# EAGLE design ArduinoShieldMotor5A (EAGLE 9.6.2)
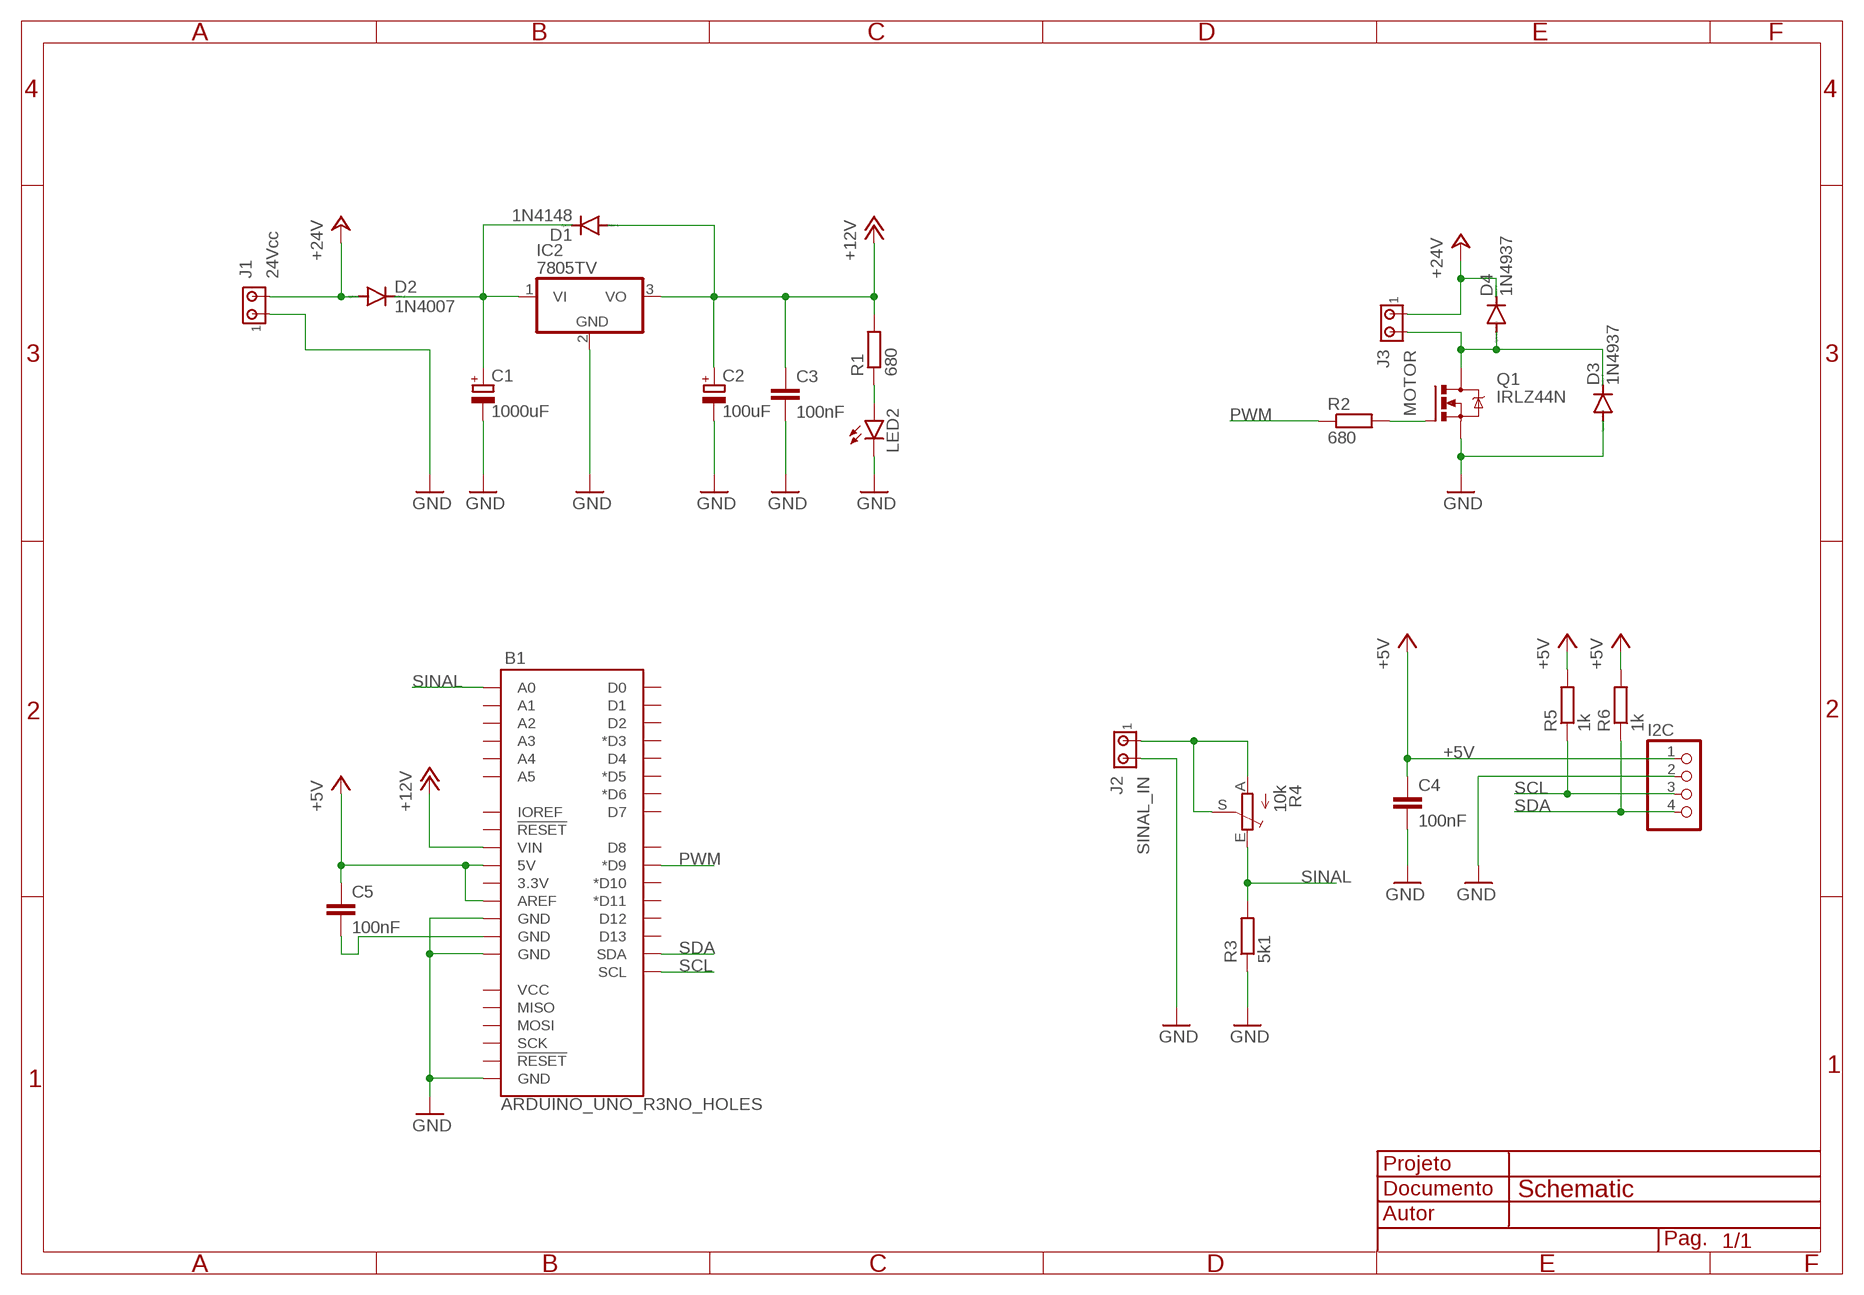
[diagram p0: schematic, sheet 1]

## Parts
B1  ARDUINO_UNO_R3NO_HOLES  [ARDUINO_R3_NO_HOLES]
C1  1000uF  CPOL-EUE5-13  [E5-13]
C2  100uF  CPOL-EUE2.5-5  [E2,5-5]
C3  100nF  C-EU025-025X050  [C025-025X050]
C4  100nF  C-EU025-025X050  [C025-025X050]
C5  100nF  C-EU025-025X050  [C025-025X050]
D1  1N4148  1N4148DO35-10  [DO35-10]
D2  1N4007  1N4004  [DO41-10]
D3  1N4937  1N4004  [DO41-10]
D4  1N4937  1N4004  [DO41-10]
I2C  PINHD-1X4  [1X04]
IC2  7805TV  [TO220V]
J1  24Vcc  MTA02-156  [1X2MTA]
J2  SINAL_IN  MTA02-156  [1X2MTA]
J3  MOTOR  MTA02-156  [1X2MTA]
LED2  LED3MM  [LED3MM]
Q1  IRLZ44N  IRF540  [TO220BV]
R1  680  R-EU_0207/10  [0207/10]
R2  680  R-EU_0207/10  [0207/10]
R3  5k1  R-EU_0207/10  [0207/10]
R4  10k  TRIM_EU-B64Y  [B64Y]
R5  1k  R-EU_0207/10  [0207/10]
R6  1k  R-EU_0207/10  [0207/10]

## Nets
+5V [power]: B1.5V B1.AREF C4.1 C5.1 I2C.1 R5.2 R6.2
+12V: B1.VIN C2.+ C3.1 D1.A IC2.3(VO) R1.2
+24V [power]: D2.A D4.C J1.2 J3.1
GND: B1.GND@1(GND) B1.GND@2(GND) B1.GND@4(GND) C1.- C2.- C3.2 C4.2 D3.A I2C.2 IC2.2(GND) J1.1 J2.2 LED2.K(C) Q1.S R3.1
N$1 [power]: C1.+ D1.C D2.C IC2.1(VI)
N$2: Q1.G R2.2
N$3: LED2.A R1.1
N$4 [power]: D3.C D4.A J3.2 Q1.D
N$5 [power]: B1.GND@3(GND) C5.2
N$6: J2.1 R4.A R4.S
PWM: B1.D9(*D9) R2.1
SCL: B1.SCL I2C.3 R5.1
SDA: B1.SDA I2C.4 R6.1
SINAL: B1.A0 R3.2 R4.E
Unconnected: B1.3.3V B1.A1 B1.A2 B1.A3 B1.A4 B1.A5 B1.D0 B1.D1 B1.D2 B1.D3(*D3) B1.D4 B1.D5(*D5) B1.D6(*D6) B1.D7 B1.D8 B1.D10(*D10) B1.D11(*D11) B1.D12 B1.D13 B1.IOREF B1.MISO B1.MOSI B1.RESET@1(!RESET!) B1.RESET@2(!RESET!) B1.SCK B1.VCC

## Notes on the sheet
- Schematic

## Library data of the parts
B1 = SparkFun-Boards:ARDUINO_UNO_R3: Arduino R3 Footprint with SPI header Arduino Uno R3 Compatible Footprint. Matches PCB size of the original board. SparkFun Products: SAMD21 Dev Breakout <https://www.sparkfun.com/products/13672> RedBoard <https://www.sparkfun.com/products/12757> R3 Stackable Headers <https://www.sparkfun.com/products/11417>
C1 C2 = rcl:CPOL-EU: POLARIZED CAPACITOR, European symbol; SPICEPREFIX: C
C3-C5 = rcl:C-EU: CAPACITOR, European symbol; SPICEPREFIX: C
D1 = diode:1N4148: DIODE high speed (Philips)
D2-D4 = diode:1N4004: DIODE general purpose rectifier, 1 A
I2C = pinhead:PINHD-1X4: PIN HEADER
IC2 = linear:78*: Positive VOLTAGE REGULATOR Source: http://cache.national.com/ds/LM/LM78L05.pdf http://www.fairchildsemi.com/ds/LM/LM7805.pdf
J1-J3 = con-amp:MTA02-156: AMP connector
LED2 = led:LED: LED OSRAM: - CHIPLED LG R971, LG N971, LY N971, LG Q971, LY Q971, LO R971, LY R971 LH N974, LH R974 LS Q976, LO Q976, LY Q976 LO Q996 - Hyper CHIPLED LW Q18S LB Q993, LB Q99A, LB R99A - SideLED LS A670, LO A670, LY A670, LG A670, LP A670 LB A673, LV A673, LT A673, LW A673 LH A674 LY A675 LS A676, LA A676, LO A676, LY A676, LW A676 LS A679, LY A679, LG A679 - Hyper Micro SIDELED® LS Y876, LA Y876, LO Y876, LY Y876 LT Y87S - SmartLED LW L88C, LW L88S LB L89C, LB L89S, LG L890 LS L89K, LO L89K, LY L89K LS L896, LA L896, LO L896, LY L896 - TOPLED LS T670, LO T670, LY T670, LG T670, LP T670 LSG T670, LSP T670, LSY T670, LOP T670, LYG T670 LG T671, LOG T671, LSG T671 LB T673, LV T673, LT T673, LW T673 LH T674 LS T676, LA T676, LO T676, LY T676, LB T676, LH T676, LSB T676, LW T676 LB T67C, LV T67C, LT T67C, LS T67K, LO T67K, LY T67K, LW E67C LS E67B, LA E67B, LO E67B, LY E67B, LB E67C, LV E67C, LT E67C LW T67C LS T679, LY T679, LG T679 LS T770, LO T770, LY T770, LG T770, LP T770 LB T773, LV T773, LT T773, LW T773 LH T774 LS E675, LA E675, LY E675, LS T675 LS T776, LA T776, LO T776, LY T776, LB T776 LHGB T686 LT T68C, LB T68C - Hyper Mini TOPLED® LB M676 - Mini TOPLED Santana® LG M470 LS M47K, LO M47K, LY M47K Source: http://www.osram.convergy.de LUXEON: - LUMILED® LXK2-PW12-R00, LXK2-PW12-S00, LXK2-PW14-U00, LXK2-PW14-V00 LXK2-PM12-R00, LXK2-PM12-S00, LXK2-PM14-U00 LXK2-PE12-Q00, LXK2-PE12-R00, LXK2-PE12-S00, LXK2-PE14-T00, LXK2-PE14-U00 LXK2-PB12-K00, LXK2-PB12-L00, LXK2-PB12-M00, LXK2-PB14-N00, LXK2-PB14-P00, LXK2-PB14-Q00 LXK2-PR12-L00, LXK2-PR12-M00, LXK2-PR14-Q00, LXK2-PR14-R00 LXK2-PD12-Q00, LXK2-PD12-R00, LXK2-PD12-S00 LXK2-PH12-R00, LXK2-PH12-S00 LXK2-PL12-P00, LXK2-PL12-Q00, LXK2-PL12-R00 Source: www.luxeon.com KINGBRIGHT: KA-3528ASYC Source: www.kingbright.com
Q1 = transistor-power:IRF540: HEXFET Power MOSFET
R1-R3 R5 R6 = rcl:R-EU_: RESISTOR, European symbol; SPICEPREFIX: R
R4 = pot:TRIM_EU-: POTENTIOMETER

## Net classes
0 default: width 1 mm, drill 1 mm, clearance 0.5 mm
1 power: width 1.5 mm, drill 1 mm, clearance 0.5 mm

## Board
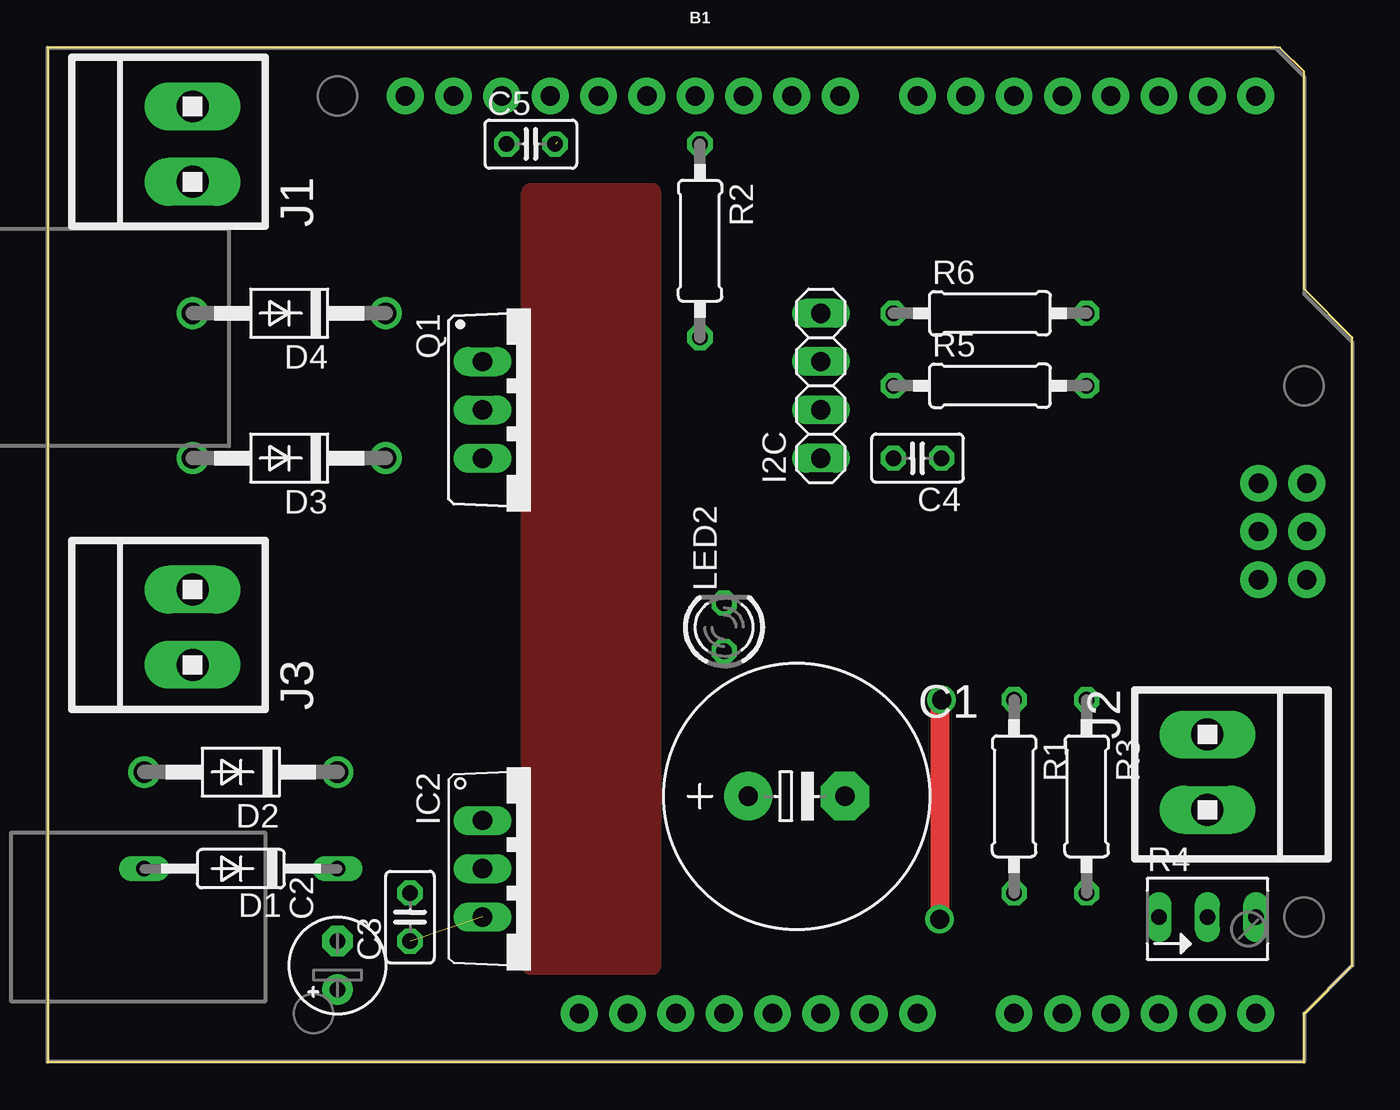
[diagram p1: board, top side]
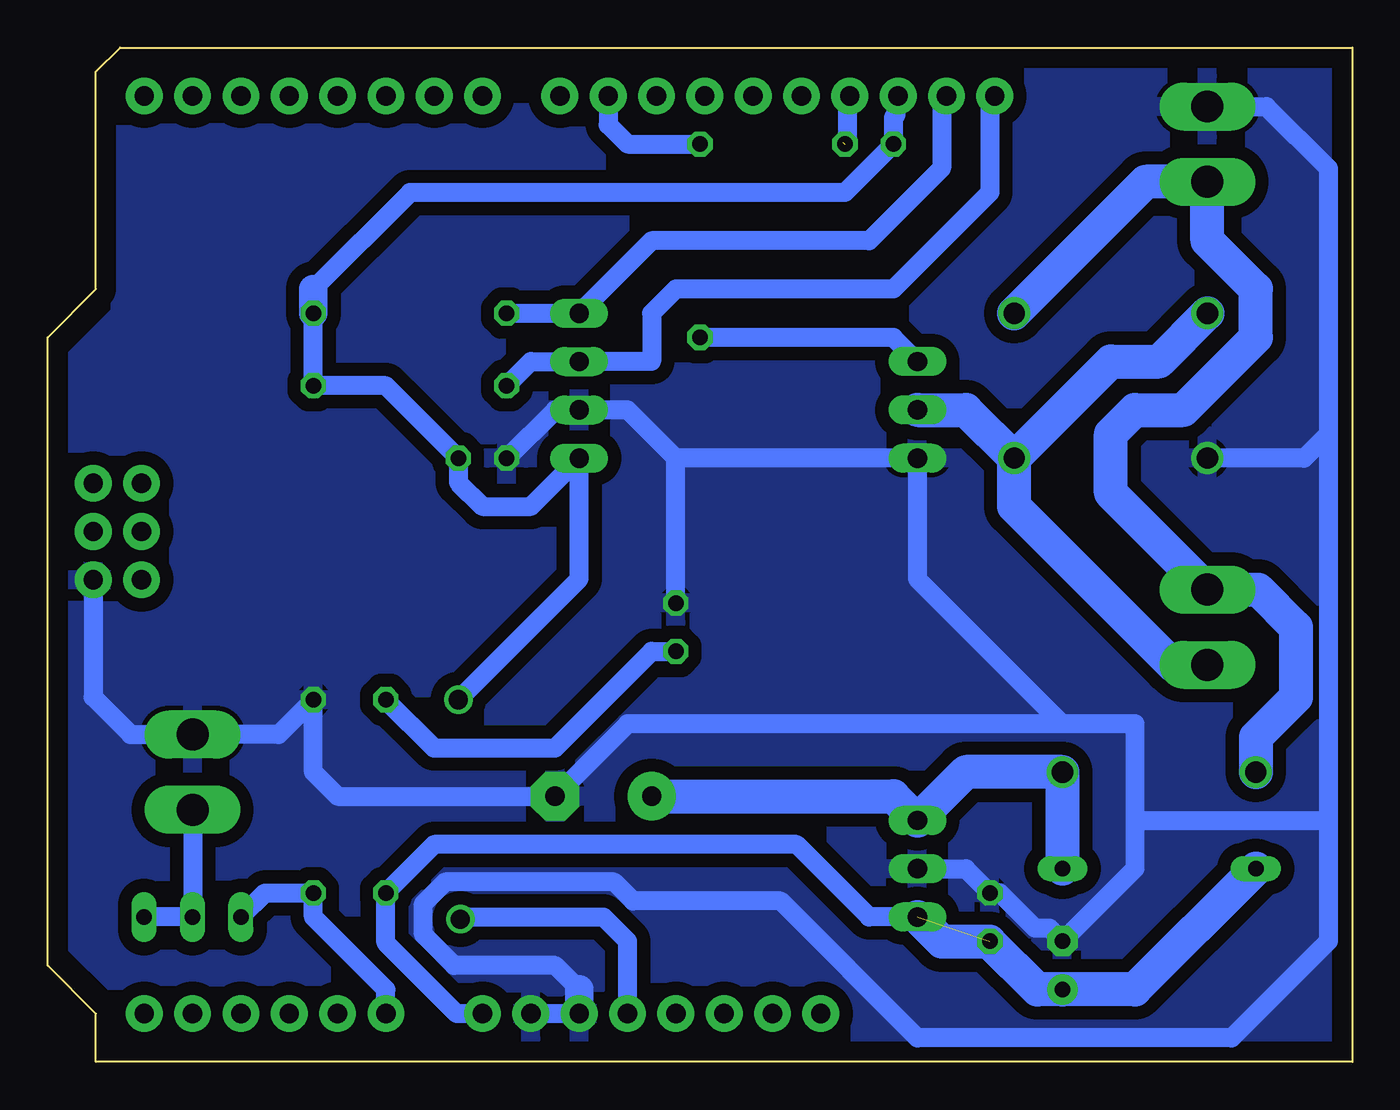
[diagram p2: board, bottom side, seen from below]

Size 68.58 x 53.34 mm. Coordinates in mm from the lower left corner, seen from the top.
Outline: 0,0 66.04,0 66.04,2.54 68.58,5.08 68.58,38.1 66.04,40.64 66.04,52.07 64.77,53.34 0,53.34 0,0
Copper layers (1*16): Top 0.035mm / dielectric 1.5mm / Bottom 0.035mm
Design rules "default *": minimum track width 10mil, minimum drill 24mil, track to track 0.7mm, track to pad 0.7mm, pad to pad 0.7mm, via to via 0.7mm, smd to smd 0.7mm, copper to edge 40mil, drill to drill 8mil, minimum pad ring 10mil, minimum via ring 8mil, stop-mask expansion 4mil, vias tented up to drill 0mil, thermal gap 10mil

### Footprints (pad centres in the part's own frame; a part is rotated, then mirrored left to right if it is on the bottom)
ARDUINO_R3_NO_HOLES = drill 1.016 pad 1.93: 3.3V 1.27,-24.13; 5V 3.81,-24.13; A0 16.51,-24.13; A1 19.05,-24.13; A2 21.59,-24.13; A3 24.13,-24.13; A4 26.67,-24.13; A5 29.21,-24.13; AREF -10.414,24.13; D0 29.21,24.13; D1 26.67,24.13; D2 24.13,24.13; D3 21.59,24.13; D4 19.05,24.13; D5 16.51,24.13; D6 13.97,24.13; D7 11.43,24.13; D8 7.366,24.13; D9 4.826,24.13; D10 2.286,24.13; D11 -0.254,24.13; D12 -2.794,24.13; D13 -5.334,24.13; GND@1 6.35,-24.13; GND@2 8.89,-24.13; GND@3 -7.874,24.13; GND@4 31.89,-1.32; IOREF -3.81,-24.13; MISO 29.35,3.76; MOSI 31.89,1.22; NC -6.35,-24.13; RESET@1 -1.27,-24.13; RESET@2 29.35,-1.32; SCK 29.35,1.22; SCL -15.494,24.13; SDA -12.954,24.13; VCC 31.89,3.76; VIN 11.43,-24.13
E5-13 = drill 1.016 pad 2.54: + -2.54,0 | drill 1.016 pad 2.54 octagon: - 2.54,0
E2,5-5 = drill 0.813 pad 1.6: + -1.27,0 | drill 0.813 pad 1.6 octagon: - 1.27,0
C025-025X050 = drill 0.813 octagon: 1 -1.27,0; 2 1.27,0
DO35-10 = drill 0.813 long: A 5.08,0; C -5.08,0
DO41-10 = drill 1.118: A 5.08,0; C -5.08,0
1X04 = drill 1.016 long: 1 -3.81,0; 2 -1.27,0; 3 1.27,0; 4 3.81,0
TO220V = drill 1.016 long: 1 -2.54,-2.54; 2 0,-2.54; 3 2.54,-2.54
1X2MTA = drill 1.676 long: 1 1.981,0; 2 -1.981,0
LED3MM = drill 0.813 octagon: A -1.27,0; K 1.27,0
TO220BV = drill 1.016 long: D 0,-2.54; G -2.54,-2.54; S 2.54,-2.54
0207/10 = drill 0.813 octagon: 1 -5.08,0; 2 5.08,0
B64Y = drill 0.813 long: A 2.54,0; E -2.54,0; S 0,0

### Placement (x,y rotation side)
B1  34.29,26.67 0 top
C1  39.37,13.97 0 top
C2  15.24,5.08 90 top
C3  19.05,7.62 90 top
C4  45.72,31.75 180 top
C5  25.4,48.26 0 top
D1  10.16,10.16 180 top
D2  10.16,15.24 180 top
D3  12.7,31.75 180 top
D4  12.7,39.37 180 top
I2C  40.64,35.56 90 top
IC2  25.4,10.16 270 top
J1  7.62,48.26 90 top
J2  60.96,15.24 270 top
J3  7.62,22.86 90 top
LED2  35.56,22.86 90 top
Q1  25.4,34.29 270 top
R1  50.8,13.97 270 top
R2  34.29,43.18 270 top
R3  54.61,13.97 270 top
R4  60.96,7.62 0 top
R5  49.53,35.56 0 top
R6  49.53,39.37 0 top

### Tracks (layer width: path | path; a pad name or v marks a point on that pad's centre or on a via)
+5V  (via drill 1)
  Top 1: v46.99,19.05 46.88,18.94 v46.88,7.51
  Bottom 1: v46.99,19.05 40.64,25.4 I2C.1 43.18,29.21 45.72,29.21 46.99,30.48 C4.1 50.8,35.56 R5.2 R6.2 | v46.88,7.51 46.77,7.62 39.37,7.62 38.1,6.35 B1.5V | 54.61,40.64 49.53,45.72 26.67,45.72 C5.1 24.13,49.67 24,49.8 24,50.67 B1.AREF
  Bottom 1.5: 54.61,40.64 R6.2
+12V  (1 unrouted)
  Bottom 1: IC2.3 25.4,7.62 29.21,11.43 48.26,11.43 R1.2 50.8,6.27 47.07,2.54 B1.VIN
  Bottom 1.778: D1.A 11.43,3.81 C2.+ 16.57,3.81 19.08,6.32 21.56,6.32 IC2.3
+24V
  Bottom 1.778: D2.A 5.08,17.07 2.97,19.18 2.97,22.86 4.95,24.84 J3.1 12.7,29.92 12.7,33.02 11.43,34.29 8.89,34.29 5.08,38.1 5.08,40.64 7.62,43.18 J1.2 10.87,46.28 D4.C
DISSIPADOR
  pour Top: 31.75,5.08 25.4,5.08 25.4,45.72 31.75,45.72
GND
  Bottom 1: J1.1 4.52,50.24 1.27,46.99 1.27,33.02 | D3.A 2.54,31.75 1.27,33.02 | IC2.2 20.32,10.16 C3.2 18.53,8.89 16.67,7.03 15.92,7.03 C2.- 11.43,10.16 11.43,12.7 | 1.27,33.02 1.27,12.7 | 1.27,12.7 1.27,6.35 6.35,1.27 22.86,1.27 30.05,8.46 37.81,8.46 38.81,9.46 47.69,9.46 48.83,8.32 48.83,6.7 47.21,5.08 41.91,5.08 40.64,3.81 | 15.24,17.78 22.86,25.4 Q1.S 35.56,31.75 | 11.43,12.7 11.43,17.78 15.24,17.78 | 15.24,17.78 38.1,17.78 C1.- 53.34,13.97 54.61,15.24 R3.1 56.44,17.22 J2.2 64.21,17.22 66.18,19.19 B1.GND@4 | 11.43,12.7 1.27,12.7 | 35.56,31.75 38.1,34.29 I2C.2 41.91,34.29 C4.2 | LED2.K 35.56,31.75 | B1.GND@1 B1.GND@2
  Bottom 1.5: B1.GND@1 40.64,3.81
  pour Bottom: 1.27,52.07 1.27,1.27 64.77,1.27 64.77,3.81 67.31,6.35 67.31,36.83 64.77,39.37 64.77,50.8 63.5,52.07
N$1
  Bottom 1.778: D1.C D2.C 20.32,15.24 IC2.1 24.13,13.97 C1.+
N$2
  Bottom 1: Q1.G 24.13,38.1 R2.2
N$3
  Bottom 1: R1.1 48.26,16.51 41.91,16.51 36.83,21.59 LED2.A
N$4
  Bottom 1.778: D3.C 12.7,36.83 10.16,36.83 D4.A | Q1.D 20.32,34.29 D3.C | D3.C 17.78,29.21 9.45,20.88 J3.2
N$5  (1 unrouted)
  Bottom 1: B1.GND@3 26.54,50.67 26.54,48.61 26.78,48.37
N$6
  Bottom 1: R4.A R4.S J2.1
PWM
  Bottom 1: B1.D9 39.12,49.28 38.1,48.26 R2.1
SCL
  Bottom 1: B1.SCL 19.05,50.55 19.05,45.72 24.13,40.64 35.56,40.64 36.83,39.37 36.83,36.83 I2C.3 43.18,36.83 R5.1
SDA
  Bottom 1: B1.SDA 21.59,50.55 21.59,46.99 25.4,43.18 36.83,43.18 I2C.4 R6.1
SINAL
  Bottom 1: R4.E 57.15,8.89 R3.2 54.61,7.62 50.8,3.81 B1.A0